# EAGLE design i2c_arduino (EAGLE 6.5.0)
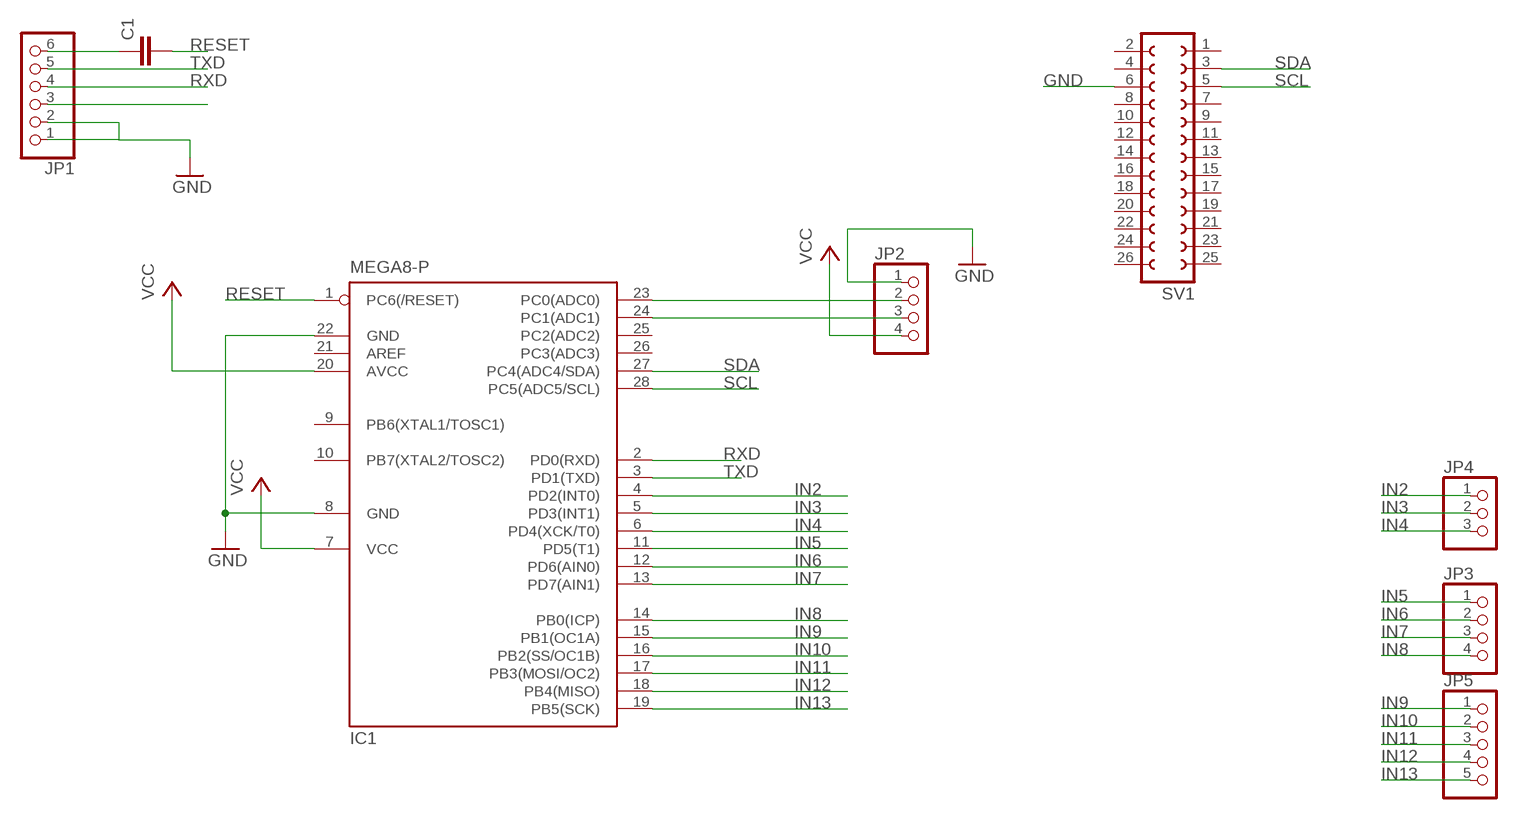
[diagram p0: schematic, sheet 1]

## Parts
C1  C-EU025-025X050  [C025-025X050]
IC1  MEGA8-P  [DIL28-3]
JP1  PINHD-1X6/90  [1X06/90]
JP2  PINHD-1X4  [1X04]
JP3  PINHD-1X4  [1X04]
JP4  PINHD-1X3  [1X03]
JP5  PINHD-1X5  [1X05]
SV1  FE13-2  [FE13-2]

## Nets
GND: IC1.8(GND) IC1.22(GND) JP1.1 JP1.2 JP2.1 SV1.6
IN2: IC1.4(PD2(INT0)) JP4.1
IN3: IC1.5(PD3(INT1)) JP4.2
IN4: IC1.6(PD4(XCK/T0)) JP4.3
IN5: IC1.11(PD5(T1)) JP3.1
IN6: IC1.12(PD6(AIN0)) JP3.2
IN7: IC1.13(PD7(AIN1)) JP3.3
IN8: IC1.14(PB0(ICP)) JP3.4
IN9: IC1.15(PB1(OC1A)) JP5.1
IN10: IC1.16(PB2(SS/OC1B)) JP5.2
IN11: IC1.17(PB3(MOSI/OC2)) JP5.3
IN12: IC1.18(PB4(MISO)) JP5.4
IN13: IC1.19(PB5(SCK)) JP5.5
N$1: C1.1 JP1.6
N$15: IC1.23(PC0(ADC0)) JP2.2
N$16: IC1.24(PC1(ADC1)) JP2.3
RESET: C1.2 IC1.1(PC6(/RESET))
RXD: IC1.2(PD0(RXD)) JP1.4
SCL: IC1.28(PC5(ADC5/SCL)) SV1.5
SDA: IC1.27(PC4(ADC4/SDA)) SV1.3
TXD: IC1.3(PD1(TXD)) JP1.5
VCC: IC1.7(VCC) IC1.20(AVCC) JP1.3 JP2.4
Unconnected: IC1.9(PB6(XTAL1/TOSC1)) IC1.10(PB7(XTAL2/TOSC2)) IC1.21(AREF) IC1.25(PC2(ADC2)) IC1.26(PC3(ADC3)) SV1.1 SV1.2 SV1.4 SV1.7 SV1.8 SV1.9 SV1.10 SV1.11 SV1.12 SV1.13 SV1.14 SV1.15 SV1.16 SV1.17 SV1.18 SV1.19 SV1.20 SV1.21 SV1.22 SV1.23 SV1.24 SV1.25 SV1.26

## Library data of the parts
C1 = rcl:C-EU: CAPACITOR, European symbol
IC1 = atmel:MEGA8-P: MICROCONTROLLER 8 Kbytes FLASH, 1 kbytes SRAM, 512 bytes EEPROM, USART, 4-channel 10 bit ADC, 2-channel 8 bit ADC Pin compatible with Atmega48, ATMega88, ATMega168 Source: avr.lbr; OC_FARNELL: unknown; OC_NEWARK: unknown
JP1 = pinhead:PINHD-1X6: PIN HEADER
JP2 JP3 = pinhead:PINHD-1X4: PIN HEADER
JP4 = pinhead:PINHD-1X3: PIN HEADER
JP5 = pinhead:PINHD-1X5: PIN HEADER
SV1 = con-lsta:FE13-2: FEMALE HEADER; OC_FARNELL: unknown; OC_NEWARK: unknown

## Board
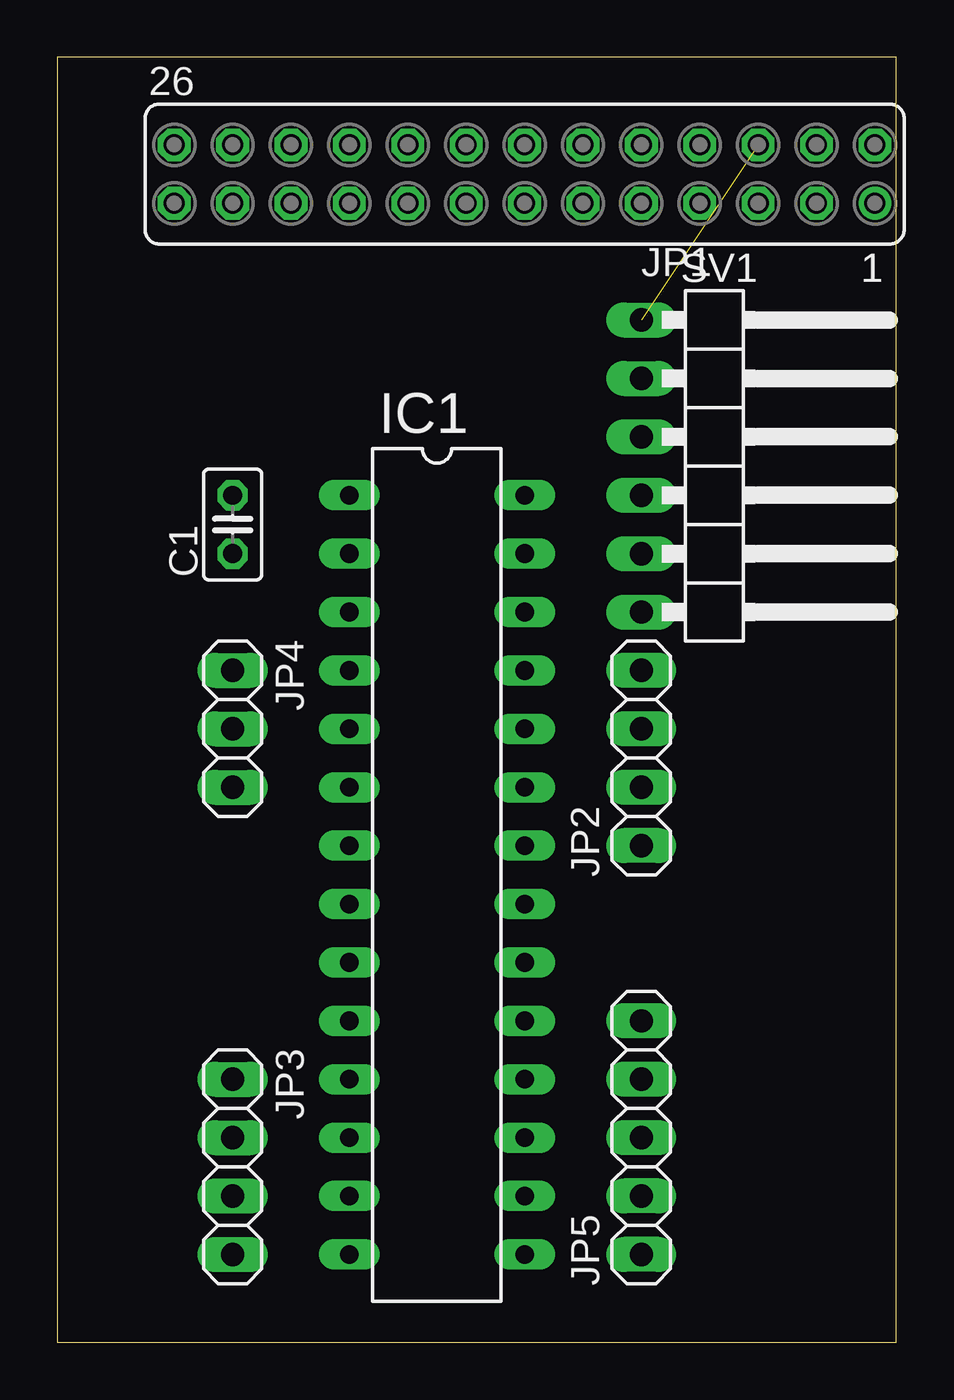
[diagram p1: board, top side]
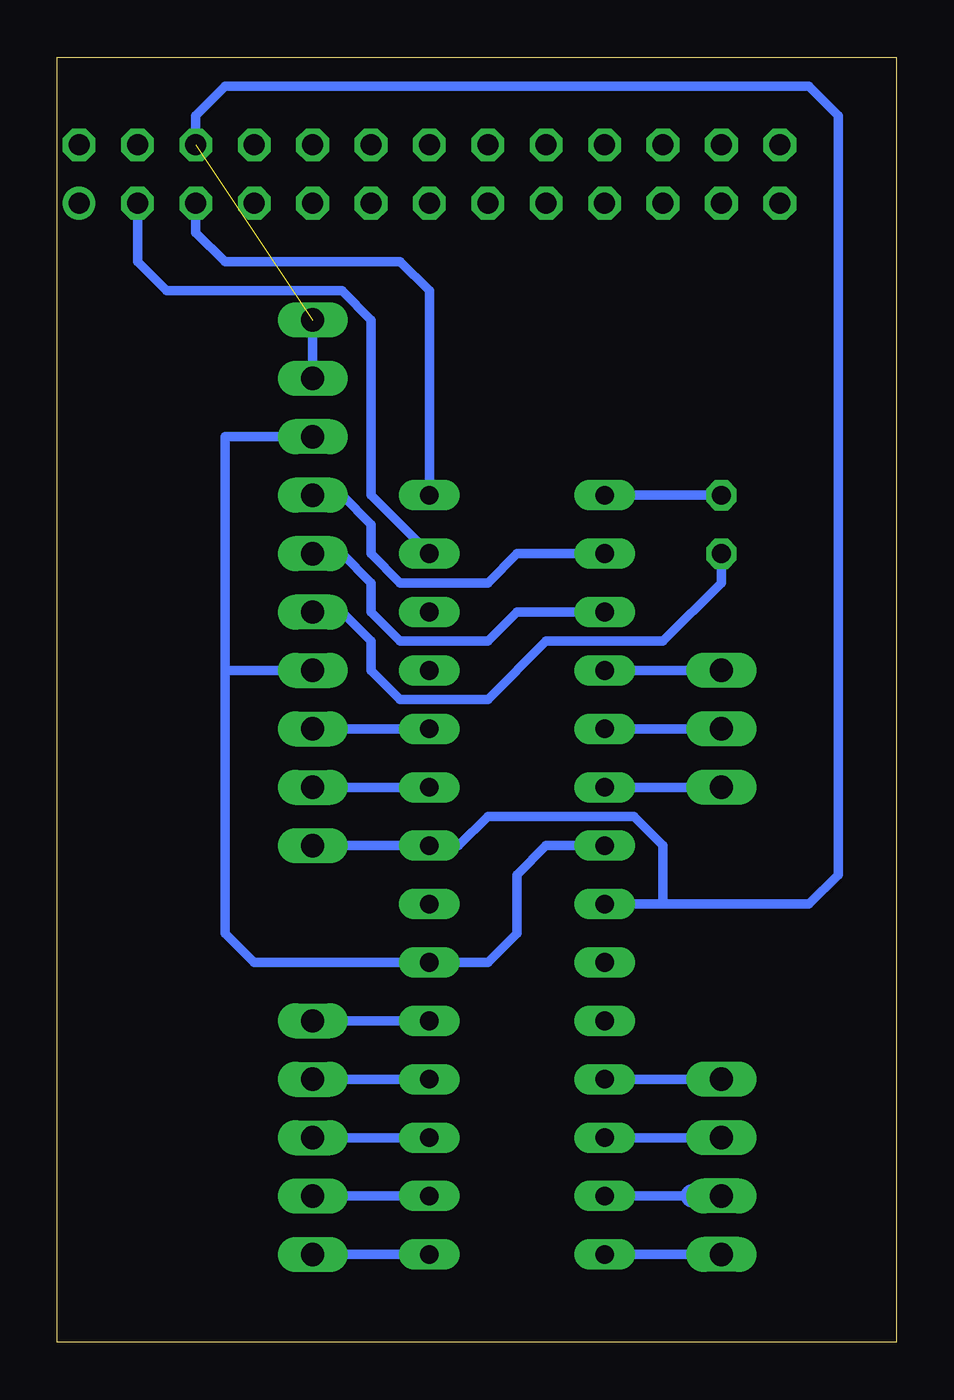
[diagram p2: board, bottom side, seen from below]

Size 36.5 x 55.87 mm. Coordinates in mm from the lower left corner, seen from the top.
Outline: 0,0 36.5,0 36.5,55.87 0,55.87 0,0
Copper layers (1*16): Top 0.035mm / dielectric 1.5mm / Bottom 0.035mm
Design rules "default": minimum track width 10mil, minimum drill 24mil, track to track 8mil, track to pad 8mil, pad to pad 8mil, via to via 8mil, smd to smd 8mil, copper to edge 40mil, drill to drill 8mil, minimum pad ring 10mil, minimum via ring 8mil, stop-mask expansion 4mil, vias tented up to drill 0mil, thermal gap 10mil

### Footprints (pad centres in the part's own frame; a part is rotated, then mirrored left to right if it is on the bottom)
C025-025X050 = drill 0.813 octagon: 1 -1.27,0; 2 1.27,0
DIL28-3 = drill 0.813 long: 1 -16.51,-3.81; 2 -13.97,-3.81; 3 -11.43,-3.81; 4 -8.89,-3.81; 5 -6.35,-3.81; 6 -3.81,-3.81; 7 -1.27,-3.81; 8 1.27,-3.81; 9 3.81,-3.81; 10 6.35,-3.81; 11 8.89,-3.81; 12 11.43,-3.81; 13 13.97,-3.81; 14 16.51,-3.81; 15 16.51,3.81; 16 13.97,3.81; 17 11.43,3.81; 18 8.89,3.81; 19 6.35,3.81; 20 3.81,3.81; 21 1.27,3.81; 22 -1.27,3.81; 23 -3.81,3.81; 24 -6.35,3.81; 25 -8.89,3.81; 26 -11.43,3.81; 27 -13.97,3.81; 28 -16.51,3.81
1X06/90 = drill 1.016 long: 1 -6.35,-3.81; 2 -3.81,-3.81; 3 -1.27,-3.81; 4 1.27,-3.81; 5 3.81,-3.81; 6 6.35,-3.81
1X04 = drill 1.016 long: 1 -3.81,0; 2 -1.27,0; 3 1.27,0; 4 3.81,0
1X03 = drill 1.016 long: 1 -2.54,0; 2 0,0; 3 2.54,0
1X05 = drill 1.016 long: 1 -5.08,0; 2 -2.54,0; 3 0,0; 4 2.54,0; 5 5.08,0
FE13-2 = drill 0.914: 1 -15.24,1.27 | drill 0.914 octagon: 2 -15.24,-1.27; 3 -12.7,1.27; 4 -12.7,-1.27; 5 -10.16,1.27; 6 -10.16,-1.27; 7 -7.62,1.27; 8 -7.62,-1.27; 9 -5.08,1.27; 10 -5.08,-1.27; 11 -2.54,1.27; 12 -2.54,-1.27; 13 0,1.27; 14 0,-1.27; 15 2.54,1.27; 16 2.54,-1.27; 17 5.08,1.27; 18 5.08,-1.27; 19 7.62,1.27; 20 7.62,-1.27; 21 10.16,1.27; 22 10.16,-1.27; 23 12.7,1.27; 24 12.7,-1.27; 25 15.24,1.27; 26 15.24,-1.27

### Placement (x,y rotation side)
C1  7.62,35.56 90 top
IC1  16.51,20.32 270 top
JP1  29.21,38.1 270 top
JP2  25.4,25.4 90 top
JP3  7.62,7.62 270 top
JP4  7.62,26.67 270 top
JP5  25.4,8.89 90 top
SV1  20.32,50.8 180 top

### Tracks (layer width: path | path; a pad name or v marks a point on that pad's centre or on a via)
GND  (1 unrouted)
  Bottom 0.406: JP2.1 IC1.22 19.05,21.59 17.78,22.86 11.43,22.86 10.16,21.59 10.16,19.05 | JP1.1 JP1.2 | SV1.6 30.48,53.34 29.21,54.61 3.81,54.61 2.54,53.34 2.54,20.32 3.81,19.05 10.16,19.05 | IC1.8 10.16,19.05
IN2
  Bottom 0.406: IC1.4 JP4.1
IN3
  Bottom 0.406: JP4.2 IC1.5
IN4
  Bottom 0.406: JP4.3 IC1.6
IN5
  Bottom 0.406: JP3.1 IC1.11
IN6
  Bottom 0.406: JP3.2 IC1.12
IN7
  Bottom 0.406: JP3.3 IC1.13
  Bottom 1.016: 8.89,6.35 JP3.3
IN8
  Bottom 0.406: JP3.4 IC1.14
IN9
  Bottom 0.406: IC1.15 JP5.1
IN10
  Bottom 0.406: JP5.2 IC1.16
IN11
  Bottom 0.406: JP5.3 IC1.17
IN12
  Bottom 0.406: JP5.4 IC1.18
IN13
  Bottom 0.406: IC1.19 JP5.5
N$1
  Bottom 0.406: JP1.6 24.13,31.75 22.86,30.48 22.86,29.21 21.59,27.94 17.78,27.94 15.24,30.48 10.16,30.48 7.62,33.02 C1.1
N$15
  Bottom 0.406: IC1.23 JP2.2
N$16
  Bottom 0.406: IC1.24 JP2.3
RESET
  Bottom 0.406: C1.2 IC1.1
RXD
  Bottom 0.406: IC1.2 16.51,34.29 17.78,33.02 21.59,33.02 22.86,34.29 22.86,35.56 24.13,36.83 JP1.4
SCL
  Bottom 0.406: IC1.28 20.32,45.72 21.59,46.99 29.21,46.99 30.48,48.26 SV1.5
SDA
  Bottom 0.406: IC1.27 22.86,36.83 22.86,44.45 24.13,45.72 31.75,45.72 33.02,46.99 SV1.3
TXD
  Bottom 0.406: IC1.3 16.51,31.75 17.78,30.48 21.59,30.48 22.86,31.75 22.86,33.02 24.13,34.29 JP1.5
VCC
  Bottom 0.406: 29.21,29.21 29.21,17.78 27.94,16.51 IC1.20 17.78,16.51 16.51,17.78 16.51,20.32 15.24,21.59 IC1.7 | 29.21,29.21 JP2.4 | JP1.3 29.21,39.37 29.21,29.21